# Altium schematic sheet Waage.SchDoc
size A4; SheetNumber: 5; SheetTotal: 6
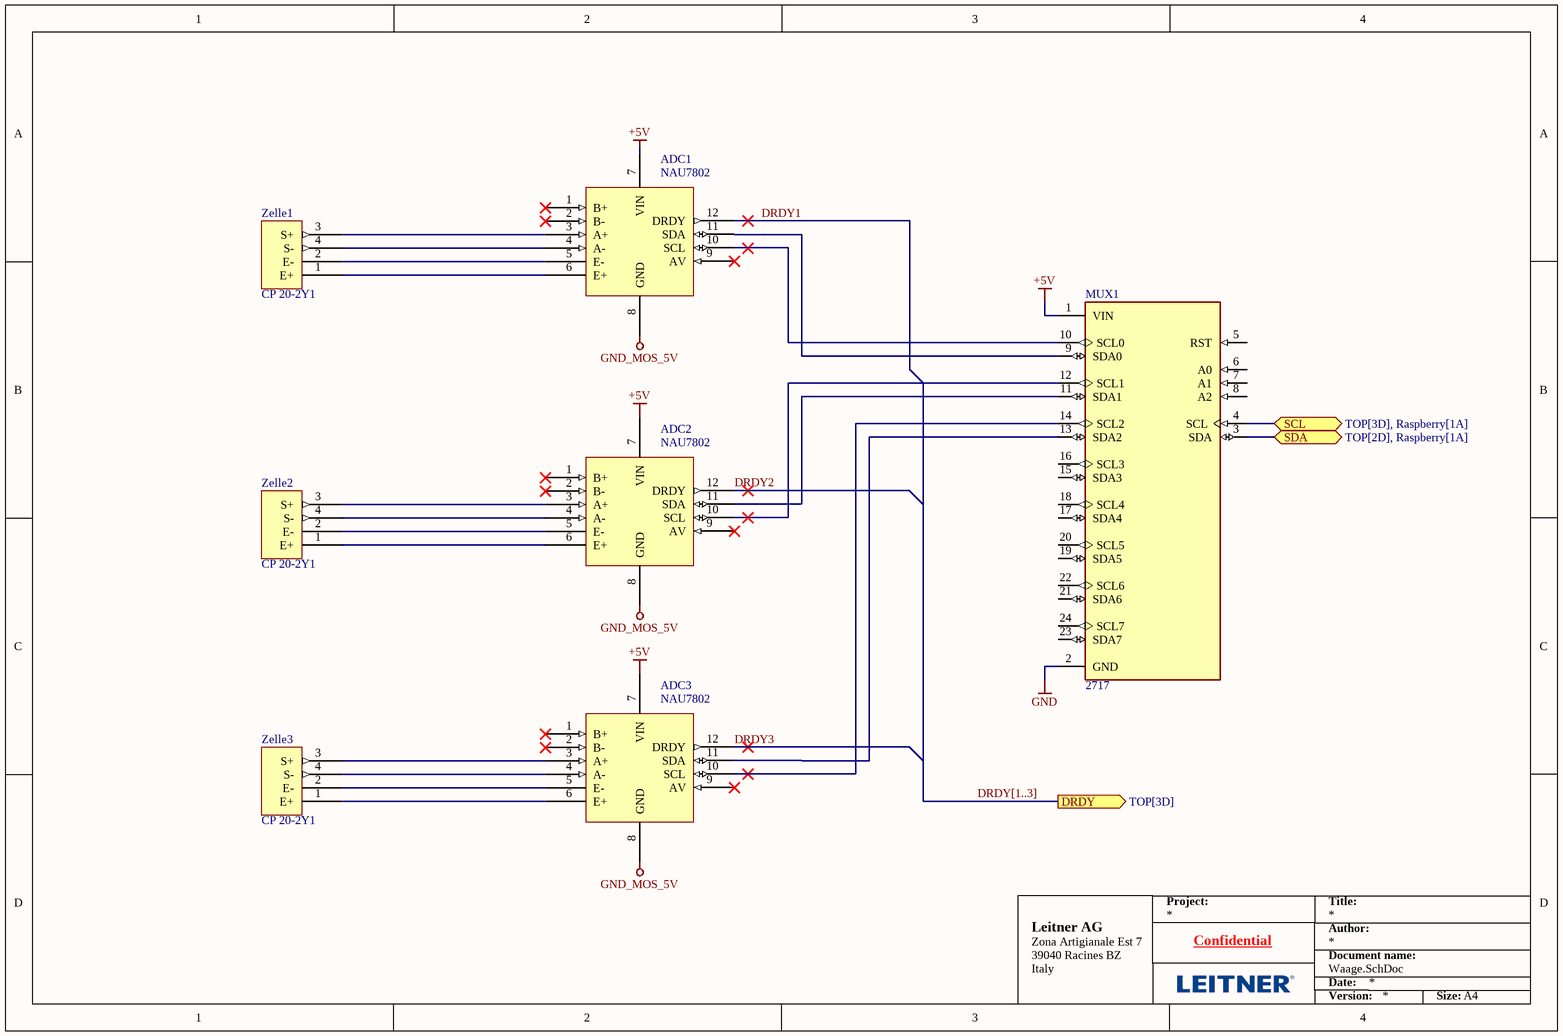
[diagram p0: Waage.SchDoc]

## Parts
ADC1  NAU7802
ADC2  NAU7802
ADC3  NAU7802
MUX1  2717  [MODULE_2717]
Zelle1  CP 20-2Y1
Zelle2  CP 20-2Y1
Zelle3  CP 20-2Y1

## Ports
DRDY (out, see TOP[3D]), SCL (bidir, see TOP[3D], Raspberry[1A]), SDA (bidir, see TOP[2D], Raspberry[1A])

## Nets
+5V: ADC1.7(VIN) ADC2.7(VIN) ADC3.7(VIN) MUX1.1(VIN)
GND: MUX1.2(GND)
GND_MOS_5V: ADC1.8(GND) ADC2.8(GND) ADC3.8(GND)
DRDY1: ADC1.12(DRDY)
DRDY2: ADC2.12(DRDY)
DRDY3: ADC3.12(DRDY)
SCL: MUX1.4(SCL) ; port SCL
SDA: MUX1.3(SDA) ; port SDA
NetADC1_3: ADC1.3(A+) Zelle1.3(S+)
NetADC1_4: ADC1.4(A-) Zelle1.4(S-)
NetADC1_5: ADC1.5(E-) Zelle1.2(E-)
NetADC1_6: ADC1.6(E+) Zelle1.1(E+)
NetADC1_10: ADC1.10(SCL) MUX1.10(SCL0)
NetADC1_11: ADC1.11(SDA) MUX1.9(SDA0)
NetADC2_3: ADC2.3(A+) Zelle2.3(S+)
NetADC2_4: ADC2.4(A-) Zelle2.4(S-)
NetADC2_5: ADC2.5(E-) Zelle2.2(E-)
NetADC2_6: ADC2.6(E+) Zelle2.1(E+)
NetADC2_10: ADC2.10(SCL) MUX1.12(SCL1)
NetADC2_11: ADC2.11(SDA) MUX1.11(SDA1)
NetADC3_3: ADC3.3(A+) Zelle3.3(S+)
NetADC3_4: ADC3.4(A-) Zelle3.4(S-)
NetADC3_5: ADC3.5(E-) Zelle3.2(E-)
NetADC3_6: ADC3.6(E+) Zelle3.1(E+)
NetADC3_10: ADC3.10(SCL) MUX1.14(SCL2)
NetADC3_11: ADC3.11(SDA) MUX1.13(SDA2)

Not connected (* = marked no-connect by the designer): ADC1 1(B+)* 2(B-)* 9(AV)*; ADC2 1(B+)* 2(B-)* 9(AV)*; ADC3 1(B+)* 2(B-)* 9(AV)*; MUX1 5(RST) 6(A0) 7(A1) 8(A2) 15(SDA3) 16(SCL3) 17(SDA4) 18(SCL4) 19(SDA5) 20(SCL5) 21(SDA6) 22(SCL6) 23(SDA7) 24(SCL7)

## Buses and harness runs
bus DRDY[1..3] = port DRDY

## Notes on the sheet
- Project:
- Title:
- Leitner AG
- Zona Artigianale Est 7
- 39040 Racines BZ
- Italy
- Confidential
- Author:
- Document name:
- Date:
- Version:
- Size:
- A4

## Library data of the parts
ADC1-ADC3 = ADC: ADAFRUIT NAU7802 24-BIT ADC - ST
MUX1 = 2717: Module: multiplexer; I2C interface multiplexer; TCA9548A; 3Ã·5VDC; MF: Adafruit; SnapEDA_Link: https://www.snapeda.com/parts/2717/Adafruit+Industries/view-part/?ref=snap; Package: None; Value: *; MP: 2717; Check_prices: https://www.snapeda.com/parts/2717/Adafruit+Industries/view-part/?ref=eda
Zelle1-Zelle3 = Wägezelle: Kern CP 20-2Y1 Wägezelle